# Altium schematic sheet Buttons.SchDoc
size A4
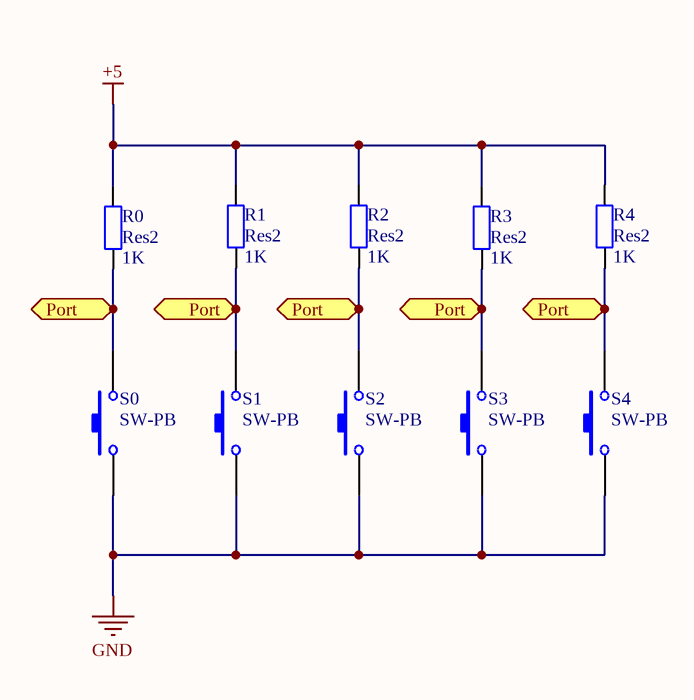
[diagram p0: Buttons.SchDoc]

## Parts
R0  Res2  value 1K  [AXIAL-0.4]
R1  Res2  value 1K  [AXIAL-0.4]
R2  Res2  value 1K  [AXIAL-0.4]
R3  Res2  value 1K  [AXIAL-0.4]
R4  Res2  value 1K  [AXIAL-0.4]
S0  SW-PB  [SPST-2]
S1  SW-PB  [SPST-2]
S2  SW-PB  [SPST-2]
S3  SW-PB  [SPST-2]
S4  SW-PB  [SPST-2]

## Ports
Port (out)

## Nets
+5: R0.2 R1.2 R2.2 R3.2 R4.1
GND: S0.1 S1.1 S2.1 S3.1 S4.1
Port: R0.1 R1.1 R2.1 R3.1 R4.2 S0.2 S1.2 S2.2 S3.2 S4.2 ; port Port

## Library data of the parts
R0-R4 = Res2: Resistor; Published: 8-Jun-2000; LatestRevisionDate: 17-Jul-2002; LatestRevisionNote: Re-released for DXP Platform.; PackageReference: AXIAL-0.4; Publisher: Altium Limited; PackageDescription: Axial Device, Thru-Hole; 2 Leads; 0.4 in Pin Spacing
S0-S4 = SW-PB: Switch; Published: 24-Mar-1999; LatestRevisionDate: 17-Jul-2002; LatestRevisionNote: Re-released for DXP Platform.; PackageReference: SPST-2; Publisher: Altium Limited; PackageDescription: Switch; 2 Leads